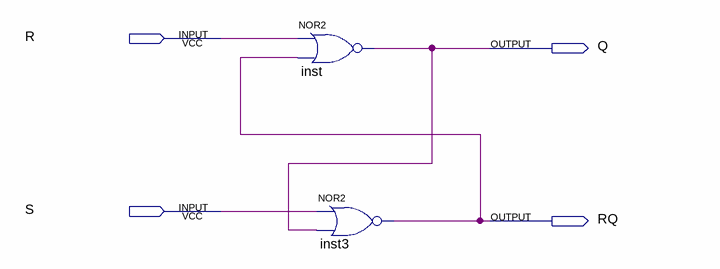
[diagram p0: schematic sheet]
// Quartus schematic Latchzinho.bdf as structural Verilog: 2 symbols, 4 pins
module Latchzinho (
  input  R,
  input  S,
  output Q,
  output RQ
);

  nor inst (Q, R, RQ);
  nor inst3 (RQ, S, Q);
endmodule
